# Altium project egse.PrjPcb (part 5 of 5)

## Sheet 7_power_prot_mon.SchDoc: Bus power control & monitoring
size A4; OrganizationName: Pluton UPV; Address1: Universitat Politècnica; Address2: de València (UPV); Address3: Camí de Vera, València; Address4: Spain; SheetNumber: 12; SheetTotal: 12
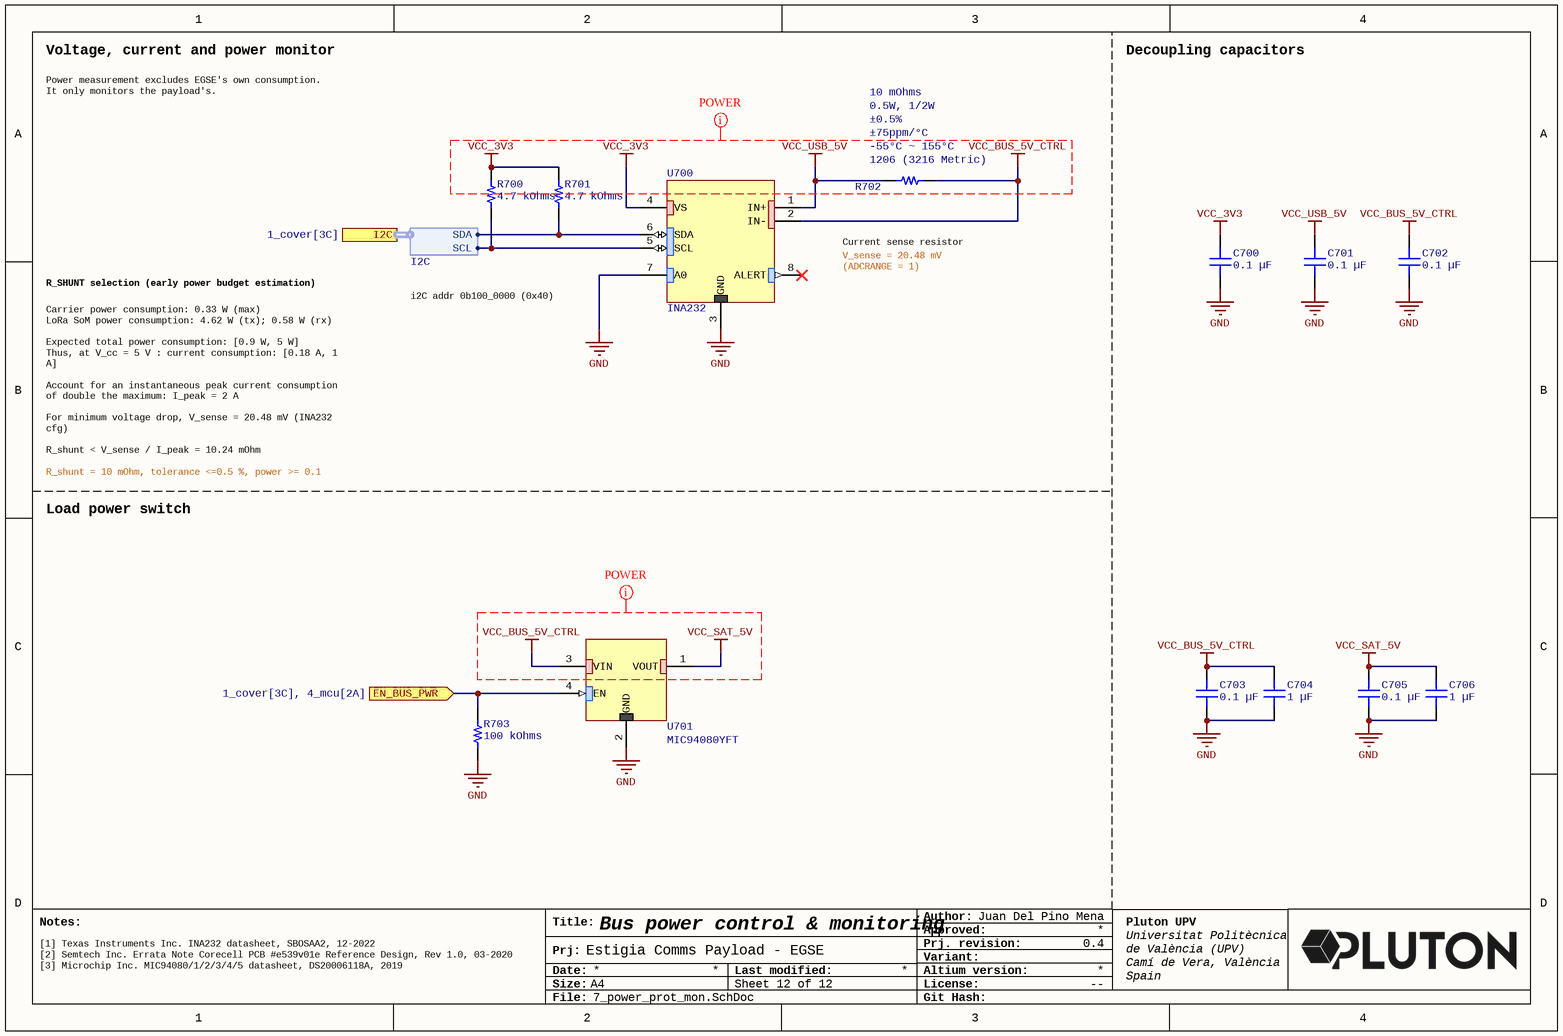
[diagram p10: 7_power_prot_mon.SchDoc]

### Parts
C700  0.1 µF  [CAP 0402_1005]
C701  0.1 µF  [CAP 0402_1005]
C702  0.1 µF  [CAP 0402_1005]
C703  0.1 µF  [CAP 0402_1005]
C704  1 µF  [CAP 0402_1005]
C705  0.1 µF  [CAP 0402_1005]
C706  1 µF  [CAP 0402_1005]
R700  4.7 kOhms  [RES 0201_0603]
R701  4.7 kOhms  [RES 0201_0603]
R702  Package / Case: 1206 (3216 Metric)  Operating Temperature: -55°C ~ 155°C  Power (Watts): 0.5W, 1/2W  Temperature Coefficient: ±75ppm/°C  Tolerance: ±0.5%  [STACKPOLE CSR1206]  (hidden comment: 10 mOhms)
R703  100 kOhms  [RES 0201_0603]
U700  INA232  [SOp-23-8]
U701  MIC94080YFT  [MIC94080YFT]

### Ports
EN_BUS_PWR (in, see 1_cover[3C], 4_mcu[2A]), I2C (harness I2C, see 1_cover[3C])

### Harnesses
I2C: SCL, SDA

### Nets
GND: C700.1 C701.1 C702.1 C703.1 C704.1 C705.1 C706.1 R703.2 U700.3(GND) U700.7(A0) U701.2(GND)
VCC_3V3: C700.2 R700.2 R701.2 U700.4(VS)
VCC_BUS_5V_CTRL: C702.2 C703.2 C704.2 R702.1 U700.2(IN-) U701.3(VIN)
VCC_SAT_5V: C705.2 C706.2 U701.1(VOUT)
VCC_USB_5V: C701.2 R702.2 U700.1(IN+)
EN_BUS_PWR: R703.1 U701.4(EN) ; port EN_BUS_PWR
NetR700_1: R700.1 U700.5(SCL) ; port I2C.SCL
NetR701_1: R701.1 U700.6(SDA) ; port I2C.SDA

Not connected (* = marked no-connect by the designer): U700 8(ALERT)*

### Layout directives
rule Width Constraint [Pref Width = 0.4mm    Min Width = 0.3mm    Max Width = 0.5mm]; net class POWER: VCC_3V3, VCC_BUS_5V_CTRL, VCC_SAT_5V, VCC_USB_5V

### Notes on the sheet
- Voltage, current and power monitor
- Power measurement excludes EGSE's own consumption. It only monitors the payload's.
- Decoupling capacitors
- Current sense resistor
- R_SHUNT selection (early power budget estimation)
- i2C addr 0b100_0000 (0x40)
- V_sense = 20.48 mV (ADCRANGE = 1)
- Carrier power consumption: 0.33 W (max)
  LoRa SoM power consumption: 4.62 W (tx); 0.58 W (rx)
  Expected total power consumption: [0.9 W, 5 W]
  Thus, at V_cc = 5 V : current consumption: [0.18 A, 1 A]
  Account for an instantaneous peak current consumption of double the maximum: I_peak = 2 A
  For minimum voltage drop, V_sense = 20.48 mV (INA232 cfg)
  R_shunt < V_sense / I_peak = 10.24 mOhm
  Power dissipated on R_shunt: 42 mW
- R_shunt = 10 mOhm, tolerance <=0.5 %, power >= 0.1 W
- Load power switch
- [1] Texas Instruments Inc. INA232 datasheet, SBOSAA2, 12-2022
  [2] Semtech Inc. Errata Note Corecell PCB #e539v01e Reference Design, Rev 1.0, 03-2020
  [3] Microchip Inc. MIC94080/1/2/3/4/5 datasheet, DS20006118A, 2019
- Notes:
- Title:
- Author:
- Approved:
- Date:
- Prj:
- Size:
- A4
- Last modified:
- Altium version:
- Variant:
- Prj. revision:
- License:
- --
- File:
- Git Hash:

### Library data of the parts
C700-C703 C705 = C0402C104K4RECAUTO: CAP CER 0402 0.1UF 16V X7R 10%; manufacturer: KEMET; Part Number: C0402C104K4RECAUTO; Value: 0.1 µF; Applications: Automotive, ESD Protection; Capacitance: 0.1 µF; componentlink1description: Datasheet; componentlink1url: https://api.kemet.com/component-edge/download/datasheet/C0402C104K4RECAUTO.pdf; componentlink2description: DigiKey Link; componentlink2url: https://www.digikey.com/en/products/detail/kemet/C0402C104K4RECAUTO/8563695; Device Package: 0402 (1005 Metric); lastupdated: 09/02/2024 20:04:38; Lifecycle Status: Active; Minimum Order: 1; Mounting Type: Surface Mount, MLCC; Operating Temperature: -55°C ~ 125°C; Package / Case: 0402 (1005 Metric); packaging: TapeAndReel; partid: 1731; Part Status: Active; price: 0.01; Ratings: AEC-Q200; series: ESD SMD Auto X7R; Size / Dimension: 0.039" L x 0.020" W (1.00mm x 0.50mm); Supplier 1: DigiKey; Supplier Part Number 1: 399-17167-1-ND; Temperature Coefficient: X7R; Thickness (Max): 0.022" (0.55mm); Tolerance: ±10%; Voltage - Rated: 16V
C704 C706 = GRT155C71A105KE13D: CAP CER 1UF 10V X7S 0402; manufacturer: Murata Electronics; Tolerance: ±10%; Part Number: GRT155C71A105KE13D; Value: 1 µF; Applications: Automotive; Capacitance: 1 µF; componentlink1description: Datasheet; componentlink1url: https://search.murata.co.jp/Ceramy/image/img/A01X/G101/ENG/GRT155C71A105KE13-01.pdf; componentlink2description: DigiKey Link; componentlink2url: https://www.digikey.com/en/products/detail/murata-electronics/GRT155C71A105KE13D/10695747; Device Package: 0402 (1005 Metric); lastupdated: 09/02/2024 20:04:05; Lifecycle Status: Active; Minimum Order: 1; Mounting Type: Surface Mount, MLCC; Operating Temperature: -55°C ~ 125°C; Package / Case: 0402 (1005 Metric); packaging: TapeAndReel; partid: 47127; Part Status: Active; price: 0.04; Ratings: AEC-Q200; series: GRT; Size / Dimension: 0.039" L x 0.020" W (1.00mm x 0.50mm); Supplier 1: DigiKey; Supplier Part Number 1: 490-GRT155C71A105KE13DCT-ND; Temperature Coefficient: X7S; Thickness (Max): 0.024" (0.60mm); Voltage - Rated: 10V
R700 R701 = AC0201FR-074K7L: RES SMD 4.7K OHM 1% 1/20W 0201; Manufacturer: Yageo; Power (Watts): 0.05W, 1/20W; Temperature Coefficient: ±200ppm/°C; Part Number: AC0201FR-074K7L; Value: 4.7 kOhms; ComponentLink1Description: Datasheet; ComponentLink1URL: https://www.yageo.com/upload/media/product/productsearch/datasheet/rchip/PYu-AC_51_RoHS_L_7.pdf; ComponentLink2Description: DigiKey Link; ComponentLink2URL: https://www.digikey.com/en/products/detail/yageo/AC0201FR-074K7L/5894686; Composition: Thick Film; Device Package: 0201 (0603 Metric); Features: Automotive AEC-Q200, Moisture Resistant; Height - Seated (Max): 0.010" (0.26mm); LastUpdated: 04/06/2024 19:11:59; Lifecycle Status: Active; Minimum Order: 1; Number of Terminations: 2; Operating Temperature: -55°C ~ 155°C; Package / Case: 0201 (0603 Metric); Packaging: CutTape; PartId: 978; Part Status: Active; Price: 0.01; Ratings: AEC-Q200; Resistance: 4.7 kOhms; Series: AC; Size / Dimension: 0.024" L x 0.012" W (0.60mm x 0.30mm); Supplier 1: DigiKey; Supplier Part Number 1: YAG3426CT-ND; Supplier Device Package: 0201; Tolerance: ±1%
R702 = L4T12FR010DER: 0.01 OHM 1206 0.5% 0.50W; Manufacturer: Ohmite; Part Number: L4T12FR010DER; ComponentLink1Description: Datasheet; ComponentLink1URL: https://www.ohmite.com/assets/docs/acl_l4t.pdf; ComponentLink2Description: DigiKey Link; ComponentLink2URL: https://www.digikey.com/en/products/detail/ohmite/L4T12FR010DER/10385195; Composition: Thick Film; Device Package: 1206 (3216 Metric); Features: Current Sense; Height - Seated (Max): 0.026" (0.65mm); LastUpdated: 03/06/2024 19:49:34; Lifecycle Status: Active; Minimum Order: 1; Number of Terminations: 4; Packaging: CutTape; PartId: 2184; Part Status: Active; Price: 0.08; Resistance: 10 mOhms; Series: L4T12; Size / Dimension: 0.118" L x 0.063" W (3.00mm x 1.60mm); Supplier 1: DigiKey; Supplier Part Number 1: 273-L4T12FR010DERCT-ND; Supplier Device Package: 1206; Value: 10 mOhms
R703 = RC0201FR-13100KL: RES 100K OHM 1% 1/20W 0201; Manufacturer: Yageo; Power (Watts): 0.05W, 1/20W; Temperature Coefficient: ±200ppm/°C; Part Number: RC0201FR-13100KL; Value: 100 kOhms; ComponentLink1Description: Datasheet; ComponentLink1URL: https://www.yageo.com/upload/media/product/productsearch/datasheet/rchip/PYu-RC_Group_51_RoHS_L_12.pdf; ComponentLink2Description: DigiKey Link; ComponentLink2URL: https://www.digikey.com/en/products/detail/yageo/RC0201FR-13100KL/17014509; Composition: Thick Film; Device Package: 0201 (0603 Metric); Features: Moisture Resistant; Height - Seated (Max): 0.010" (0.26mm); LastUpdated: 04/06/2024 19:11:47; Lifecycle Status: Active; Minimum Order: 1; Number of Terminations: 2; Operating Temperature: -55°C ~ 125°C; Package / Case: 0201 (0603 Metric); Packaging: CutTape; PartId: 80199; Price: 0.01; Resistance: 100 kOhms; Series: RC_L; Size / Dimension: 0.024" L x 0.012" W (0.60mm x 0.30mm); Supplier 1: DigiKey; Supplier Part Number 1: 13-RC0201FR-13100KLCT-ND; Supplier Device Package: 0201; Tolerance: ±1%
U700 = INA232: 48-V, 16-Bit, Current, Voltage, and Power Monitor With an I2C Interface
U701 = MIC94080YFT: 67 mΩ RDS(ON) 2A High-Side Load Switch in 0.85 mm x 0.85 mm FTDFN Package

## Sheet 3_ports.SchDoc: Ports
size A4; OrganizationName: Pluton UPV; Address1: Universitat Politècnica; Address2: de València (UPV); Address3: Camí de Vera, València; Address4: Spain; SheetNumber: 4; SheetTotal: 12
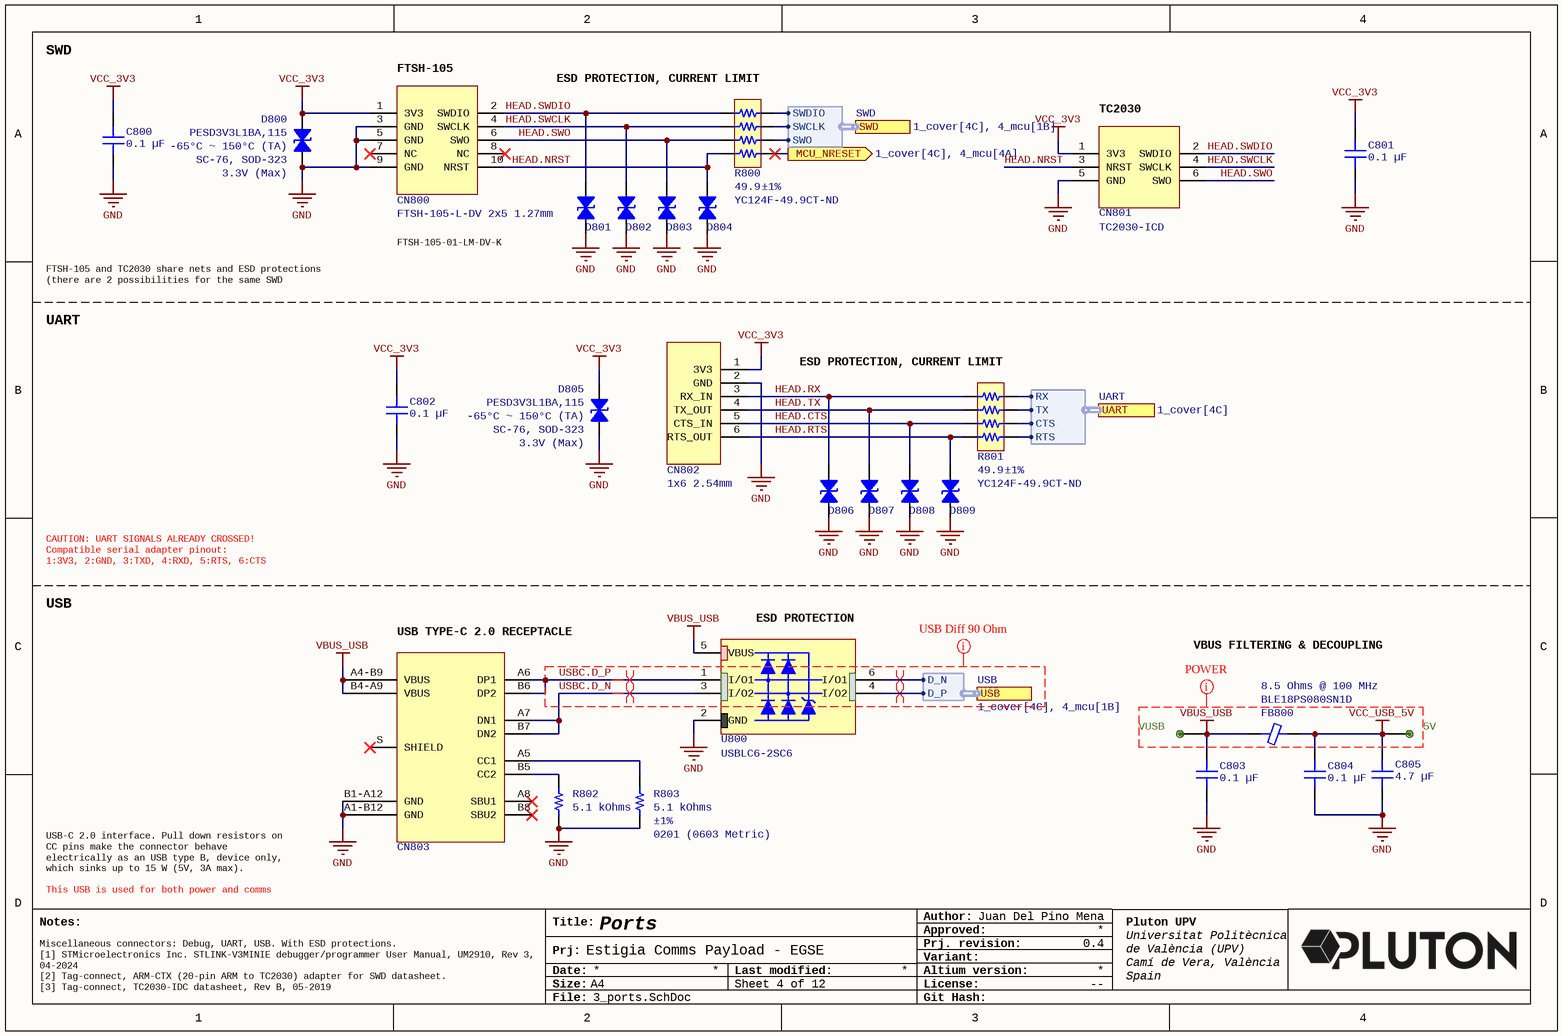
[diagram p11: 3_ports.SchDoc]

### Parts
5V  (no value)  [testpoint_via]  (no BOM)
C800  0.1 µF  [CAP 0402_1005]
C801  0.1 µF  [CAP 0402_1005]
C802  0.1 µF  [CAP 0402_1005]
C803  0.1 µF  [CAP 0402_1005]
C804  0.1 µF  [CAP 0402_1005]
C805  4.7 µF  [CAP 0603_1608]
CN800  FTSH-105-L-DV 2x5 1.27mm  [Samtec ftsh-105-l-dv]
CN801  TC2030-ICD  [TC2030-MCP-NL]  (no BOM)
CN802  1x6 2.54mm  [Header 1x6 2.54mm]  (no BOM)
CN803  USB4105-GF-A  [USB4105-GF-A]  (value not drawn)
D800  Operating Temperature: -65°C ~ 150°C (TA)  Package / Case: SC-76, SOD-323  Voltage - Reverse Standoff (Typ): 3.3V (Max)  [SOD323]  (hidden comment: PESD3V3L1BA,115)
D801  PESD3V3L1BA,115  [SOD323]  (value not drawn)
D802  PESD3V3L1BA,115  [SOD323]  (value not drawn)
D803  PESD3V3L1BA,115  [SOD323]  (value not drawn)
D804  PESD3V3L1BA,115  [SOD323]  (value not drawn)
D805  Operating Temperature: -65°C ~ 150°C (TA)  Package / Case: SC-76, SOD-323  Voltage - Reverse Standoff (Typ): 3.3V (Max)  [SOD323]  (hidden comment: PESD3V3L1BA,115)
D806  PESD3V3L1BA,115  [SOD323]  (value not drawn)
D807  PESD3V3L1BA,115  [SOD323]  (value not drawn)
D808  PESD3V3L1BA,115  [SOD323]  (value not drawn)
D809  PESD3V3L1BA,115  [SOD323]  (value not drawn)
FB800  Part Number: BLE18PS080SN1D  [FER 0603_1608]  (hidden comment: 8.5 Ohms @ 100 MHz)
R800  Resistance (Ohms): 49.9  Supplier Part Number 1: YC124F-49.9CT-ND  Tolerance: ±1%  [RESNET 0804-8 CONVEX]  (hidden comment: YC124-FR-0749R9L)
R801  Resistance (Ohms): 49.9  Supplier Part Number 1: YC124F-49.9CT-ND  Tolerance: ±1%  [RESNET 0804-8 CONVEX]  (hidden comment: YC124-FR-0749R9L)
R802  5.1 kOhms  [RES 0201_0603]
R803  Device Package: 0201 (0603 Metric)  Tolerance: ±1%  [RES 0201_0603]  (hidden comment: 5.1 kOhms)
U800  USBLC6-2SC6  [SOT23-6L]
VUSB  (no value)  [testpoint_via]  (no BOM)

### Ports
MCU_NRESET (out, see 1_cover[4C], 4_mcu[4A]), SWD (harness SWD, see 1_cover[4C], 4_mcu[1B]), UART (harness UART, see 1_cover[4C]), USB (harness USB, see 1_cover[4C], 4_mcu[1B])

### Harnesses
SWD: SWDIO, SWCLK, SWO
UART: TX, CTS, RTS, RX
USB: D_N, D_P

### Nets
GND: C800.1 C801.1 C802.1 C803.1 C804.1 C805.1 CN800.3(GND) CN800.5(GND) CN800.9(GND) CN801.5(GND) CN802.2(GND) CN803.A1-B12(GND) CN803.B1-A12(GND) D800.1 D801.1 D802.1 D803.1 D804.1 D805.1 D806.1 D807.1 D808.1 D809.1 R802.1 R803.1 U800.2(GND)
VBUS_USB: C803.2 CN803.A4-B9(VBUS) CN803.B4-A9(VBUS) FB800.1 U800.5(VBUS) VUSB.0
VCC_3V3: C800.2 C801.2 C802.2 CN800.1(3V3) CN801.1(3V3) CN802.1(3V3) D800.2 D805.2
VCC_USB_5V: 5V.0 C804.2 C805.2 FB800.2
HEAD.CTS: CN802.5(CTS_IN) D808.2 R801.3  [project net HEAD.CTS_4]
HEAD.NRST: CN800.10(NRST) CN801.3(NRST) D804.2 R800.4  [project net HEAD.NRST_4]
HEAD.RTS: CN802.6(RTS_OUT) D809.2 R801.4  [project net HEAD.RTS_4]
HEAD.RX: CN802.3(RX_IN) D806.2 R801.1  [project net HEAD.RX_4]
HEAD.SWCLK: CN800.4(SWCLK) CN801.4(SWCLK) D802.2 R800.2  [project net HEAD.SWCLK_4]
HEAD.SWDIO: CN800.2(SWDIO) CN801.2(SWDIO) D801.2 R800.1  [project net HEAD.SWDIO_4]
HEAD.SWO: CN800.6(SWO) CN801.6(SWO) D803.2 R800.3  [project net HEAD.SWO_4]
HEAD.TX: CN802.4(TX_OUT) D807.2 R801.2  [project net HEAD.TX_4]
MCU_NRESET: R800.5 ; port MCU_NRESET
SWD.SWO: R800.6 ; port SWD.SWO
UART4.CTS: R801.6 ; port UART.CTS
UART4.RTS: R801.5 ; port UART.RTS
USBC.D_N: CN803.A7(DN1) CN803.B7(DN2) U800.3(I/O2)  [project net USBC.D_N_4]
USBC.D_P: CN803.A6(DP1) CN803.B6(DP2) U800.1(I/O1)  [project net USBC.D_P_4]
NetCN803_A5: CN803.A5(CC1) R803.2
NetCN803_B5: CN803.B5(CC2) R802.2
NetR800_7: R800.7 ; port SWD.SWCLK
NetR800_8: R800.8 ; port SWD.SWDIO
NetR801_7: R801.7 ; port UART.TX
NetR801_8: R801.8 ; port UART.RX
NetU400_44: U800.6(I/O1) ; port USB.D_N
NetU400_45: U800.4(I/O2) ; port USB.D_P

Not connected (* = marked no-connect by the designer): CN800 7(NC)* 8(NC)*; CN803 A8(SBU1)* B8(SBU2)* S(SHIELD)*

### Layout directives
differential pair: NetU400_44, NetU400_45, USBC.D_N_4, USBC.D_P_4
rule Width Constraint [Pref Width = 0.4mm    Min Width = 0.3mm    Max Width = 0.5mm]; net class POWER: VBUS_USB, VCC_USB_5V
net class USB90; rule Differential Pairs Routing [Pref Gap = 0.127mm    Min Gap  = 0.127mm    Max Gap  = 0.127mmPref Width = 0.269mm    Min Width  = 0.269mm    Max Width  = 0.269mm]: USBC.D_N, USBC.D_P

### Notes on the sheet
- SWD
- (near CN800) FTSH-105
- (near R800) ESD PROTECTION, CURRENT LIMIT
- (near CN801) TC2030
- FTSH-105-01-LM-DV-K
- FTSH-105 and TC2030 share nets and ESD protections (there are 2 possibilities for the same SWD interface!)
- UART
- (near R801) ESD PROTECTION, CURRENT LIMIT
- CAUTION: UART SIGNALS ALREADY CROSSED!
  Compatible serial adapter pinout:
  1:3V3, 2:GND, 3:TXD, 4:RXD, 5:RTS, 6:CTS
- USB
- (near CN803) USB TYPE-C 2.0 RECEPTACLE
- (near U800) ESD PROTECTION
- VBUS FILTERING & DECOUPLING
- USB-C 2.0 interface. Pull down resistors on CC pins make the connector behave electrically as an USB type B, device only, which sinks up to 15 W (5V, 3A max).
- This USB is used for both power and comms
- Miscellaneous connectors: Debug, UART, USB. With ESD protections.
  [1] STMicroelectronics Inc. STLINK-V3MINIE debugger/programmer User Manual, UM2910, Rev 3, 04-2024
  [2] Tag-connect, ARM-CTX (20-pin ARM to TC2030) adapter for SWD datasheet.
  [3] Tag-connect, TC2030-IDC datasheet, Rev B, 05-2019
  [4] STMicroelectronics Inc. AN4879, Rev 6,
- Notes:
- Title:
- Author:
- Approved:
- Date:
- Prj:
- Size:
- A4
- Last modified:
- Altium version:
- Variant:
- Prj. revision:
- License:
- --
- File:
- Git Hash:

### Library data of the parts
5V VUSB = TestPoint-VIA: Test point, thru-hole
C800-C804 = C0402C104K4RECAUTO: as C700 on sheet 7_power_prot_mon; Part Number: C0402C104K4RECAUTO; Value: 0.1 µF; Applications: Automotive, ESD Protection; Capacitance: 0.1 µF; componentlink1description: Datasheet; componentlink1url: https://api.kemet.com/component-edge/download/datasheet/C0402C104K4RECAUTO.pdf; componentlink2description: DigiKey Link; componentlink2url: https://www.digikey.com/en/products/detail/kemet/C0402C104K4RECAUTO/8563695; Device Package: 0402 (1005 Metric); lastupdated: 09/02/2024 20:04:38; Lifecycle Status: Active; Minimum Order: 1; Mounting Type: Surface Mount, MLCC; Operating Temperature: -55°C ~ 125°C; Package / Case: 0402 (1005 Metric); packaging: TapeAndReel; partid: 1731; Part Status: Active; price: 0.01; Ratings: AEC-Q200; series: ESD SMD Auto X7R; Size / Dimension: 0.039" L x 0.020" W (1.00mm x 0.50mm); Supplier 1: DigiKey; Supplier Part Number 1: 399-17167-1-ND; Temperature Coefficient: X7R; Thickness (Max): 0.022" (0.55mm); Tolerance: ±10%; Voltage - Rated: 16V
C805 = GRM188Z71C475KE21J: CAP CER 4.7UF 16V X7R 0603; manufacturer: Murata Electronics; Tolerance: ±10%; Part Number: GRM188Z71C475KE21J; Value: 4.7 µF; Applications: General Purpose; Capacitance: 4.7 µF; componentlink1description: Datasheet; componentlink1url: https://search.murata.co.jp/Ceramy/image/img/A01X/G101/ENG/GRM188Z71C475KE21-01A.pdf; componentlink2description: DigiKey Link; componentlink2url: https://www.digikey.com/en/products/detail/murata-electronics/GRM188Z71C475KE21J/16033436; Device Package: 0603 (1608 Metric); lastupdated: 09/02/2024 20:09:51; Lifecycle Status: Active; Minimum Order: 1; Mounting Type: Surface Mount, MLCC; Operating Temperature: -55°C ~ 125°C; Package / Case: 0603 (1608 Metric); packaging: TapeAndReel; partid: 41988; Part Status: Active; price: 0.04; series: GRM; Size / Dimension: 0.063" L x 0.031" W (1.60mm x 0.80mm); Supplier 1: DigiKey; Supplier Part Number 1: 490-GRM188Z71C475KE21JCT-ND; Temperature Coefficient: X7R; Thickness (Max): 0.039" (1.00mm); Voltage - Rated: 16V
CN800 = SWD Header 2x5 1.27mm: Samtec FTSH-105-L-DV
CN802 = UART Header 1x6 2.54mm: Header 1x6 2.54mm
CN803 = USB-C USB4105-GF-A: z
D800 D805 = PESD3V3L1BA,115: TVS DIODE 3.3VWM 26VC SOD323; Manufacturer: Nexperia USA Inc.; Bidirectional Channels: 1; Capacitance @ Frequency: 101pF @ 1MHz; Current - Peak Pulse (10/1000µs): 18A (8/20µs); Power Line Protection: No; Power - Peak Pulse: 500W; Type: Zener; Voltage - Breakdown (Min): 5.8V; Voltage - Clamping (Max) @ Ipp: 26V; Part Number: PESD3V3L1BA,115; Applications: General Purpose; ComponentLink1Description: Datasheet; ComponentLink1URL: https://assets.nexperia.com/documents/data-sheet/PESDXL1BA_SER.pdf; ComponentLink2Description: DigiKey Link; ComponentLink2URL: https://www.digikey.com/en/products/detail/nexperia-usa-inc/PESD3V3L1BA-115/1157438; LastUpdated: 03/06/2024 20:22:28; Lifecycle Status: Active; Minimum Order: 1; Mounting Type: Surface Mount; Packaging: TapeAndReel; PartId: 9994; Part Status: Active; Price: 0.06; Series: -; Supplier 1: DigiKey; Supplier Part Number 1: 1727-3825-1-ND; Supplier Device Package: SOD-323
D801-D804 D806-D809 = PESD3V3L1BA,115: TVS DIODE 3.3VWM 26VC SOD323; Manufacturer: Nexperia USA Inc.; Bidirectional Channels: 1; Capacitance @ Frequency: 101pF @ 1MHz; Current - Peak Pulse (10/1000µs): 18A (8/20µs); Power Line Protection: No; Power - Peak Pulse: 500W; Type: Zener; Voltage - Breakdown (Min): 5.8V; Voltage - Clamping (Max) @ Ipp: 26V; Voltage - Reverse Standoff (Typ): 3.3V (Max); Part Number: PESD3V3L1BA,115; Applications: General Purpose; ComponentLink1Description: Datasheet; ComponentLink1URL: https://assets.nexperia.com/documents/data-sheet/PESDXL1BA_SER.pdf; ComponentLink2Description: DigiKey Link; ComponentLink2URL: https://www.digikey.com/en/products/detail/nexperia-usa-inc/PESD3V3L1BA-115/1157438; LastUpdated: 03/06/2024 20:22:28; Lifecycle Status: Active; Minimum Order: 1; Mounting Type: Surface Mount; Operating Temperature: -65°C ~ 150°C (TA); Package / Case: SC-76, SOD-323; Packaging: TapeAndReel; PartId: 9994; Part Status: Active; Price: 0.06; Series: -; Supplier 1: DigiKey; Supplier Part Number 1: 1727-3825-1-ND; Supplier Device Package: SOD-323
FB800 = BLE18PS080SN1D: FERRITE BEAD 8.5 OHM 0603 1LN; Manufacturer: Murata Electronics; Current Rating (Max): 8A; DC Resistance (DCR) (Max): 4mOhm; Filter Type: Power Line; Number of Lines: 1; ComponentLink1Description: Datasheet; ComponentLink1URL: https://www.murata.com/products/productdata/8800169525278/ENFA0080.pdf; ComponentLink2Description: DigiKey Link; ComponentLink2URL: https://www.digikey.com/en/products/detail/murata-electronics/BLE18PS080SN1D/13904803; Device Package: 0603 (1608 Metric); Height (Max): 0.030" (0.75mm); Impedance @ Frequency: 8.5 Ohms @ 100 MHz; LastUpdated: 03/06/2024 19:51:46; Lifecycle Status: Active; Minimum Order: 1; Mounting Type: Surface Mount; Operating Temperature: -55°C ~ 125°C; Package / Case: 0603 (1608 Metric); Packaging: TapeAndReel; PartId: 2651; Part Status: Active; Price: 0.08; Series: EMIFIL®, BLE18; Size / Dimension: 0.063" L x 0.031" W (1.60mm x 0.80mm); Supplier 1: DigiKey; Supplier Part Number 1: 490-BLE18PS080SN1DCT-ND; Value: 8.5 Ohms @ 100 MHz
R800 R801 = YC124-FR-0749R9L: RES ARRAY 4 RES 49.9 OHM 0804; Manufacturer: Yageo; Circuit Type: Isolated; Number of Resistors: 4; Power Per Element: 62.5mW; Temperature Coefficient: ±200ppm/°C; Part Number: YC124-FR-0749R9L; Applications: DDRAM, SDRAM; ComponentLink1Description: Datasheet; ComponentLink1URL: https://www.yageo.com/upload/media/product/productsearch/datasheet/rchip/PYu-YC_TC_group_51_RoHS_L_9.pdf; ComponentLink2Description: DigiKey Link; ComponentLink2URL: https://www.digikey.com/en/products/detail/yageo/YC124-FR-0749R9L/2827647; Height - Seated (Max): 0.022" (0.55mm); LastUpdated: 03/06/2024 20:05:56; Lifecycle Status: Active; Minimum Order: 1; Mounting Type: Surface Mount; Number of Pins: 8; Operating Temperature: -55°C ~ 155°C; Package / Case: 0804, Convex, Long Side Terminals; Packaging: TapeAndReel; PartId: 501; Part Status: Active; Price: 0.03; Series: YC124; Size / Dimension: 0.079" L x 0.039" W (2.00mm x 1.00mm); Supplier 1: DigiKey
R802 R803 = AC0201FR-075K1L: RES SMD 5.1K OHM 1% 1/20W 0201; Manufacturer: Yageo; Power (Watts): 0.05W, 1/20W; Temperature Coefficient: ±200ppm/°C; Part Number: AC0201FR-075K1L; Value: 5.1 kOhms; ComponentLink1Description: Datasheet; ComponentLink1URL: https://www.yageo.com/upload/media/product/productsearch/datasheet/rchip/PYu-AC_51_RoHS_L_7.pdf; ComponentLink2Description: DigiKey Link; ComponentLink2URL: https://www.digikey.com/en/products/detail/yageo/AC0201FR-075K1L/5894738; Composition: Thick Film; Features: Automotive AEC-Q200, Moisture Resistant; Height - Seated (Max): 0.010" (0.26mm); LastUpdated: 04/06/2024 19:12:02; Lifecycle Status: Active; Minimum Order: 1; Number of Terminations: 2; Operating Temperature: -55°C ~ 155°C; Package / Case: 0201 (0603 Metric); Packaging: TapeAndReel; PartId: 225; Part Status: Active; Price: 0.01; Ratings: AEC-Q200; Resistance: 5.1 kOhms; Series: AC; Size / Dimension: 0.024" L x 0.012" W (0.60mm x 0.30mm); Supplier 1: DigiKey; Supplier Part Number 1: YAG5228CT-ND; Supplier Device Package: 0201
  R802: Device Package: 0201 (0603 Metric); Tolerance: ±1%

## Nets that join several sheets
GND: 2_cubesat_bus (34 pins), 2_1_bus_breakout (10 pins), 6_power_dcdc (42 pins), 4_mcu (21 pins), 5_rf_path (29 pins), 5_2_switches (22 pins), 5_3_frontend (24 pins), 5_1_attenuators (46 pins), 5_4_transceiver (21 pins), 7_power_prot_mon (11 pins), 3_ports (26 pins)
VCC_3V3: 2_cubesat_bus (8 pins), 6_power_dcdc (12 pins), 4_mcu (13 pins), 7_power_prot_mon (C700.2 R700.2 R701.2 U700.4), 3_ports (8 pins)
VCC_RF_3V3: 6_power_dcdc (7 pins), 5_2_switches (8 pins), 5_3_frontend (5 pins), 5_1_attenuators (20 pins), 5_4_transceiver (9 pins)
VCC_RF_3V9: 6_power_dcdc (8 pins), 5_3_frontend (8 pins)
VCC_SAT_5V: 2_cubesat_bus (16 pins), 2_1_bus_breakout (CN202.25 CN202.26 CN203.25 CN203.26), 7_power_prot_mon (C705.2 C706.2 U701.1)
VCC_USB_5V: 6_power_dcdc (14 pins), 7_power_prot_mon (C701.2 R702.2 U700.1), 3_ports (5V.0 C804.2 C805.2 FB800.2)
ANTENNA: 5_rf_path (L500.1), 5_1_attenuators (U500.2)
ATT_CTRL.C0_5: 4_mcu (U400.40), 5_rf_path (C509.2 R502.9), 5_1_attenuators (U502.20 U503.20 U504.20 U505.20)
ATT_CTRL.C1: 4_mcu (U400.39), 5_rf_path (C508.2 R502.10), 5_1_attenuators (U502.19 U503.19 U504.19 U505.19)
ATT_CTRL.C2: 4_mcu (U400.38), 5_rf_path (C507.2 R502.11), 5_1_attenuators (U502.17 U503.17 U504.17 U505.17)
ATT_CTRL.C4: 4_mcu (U400.43), 5_rf_path (C506.2 R502.12), 5_1_attenuators (U502.16 U503.16 U504.16 U505.16)
ATT_CTRL.C8: 4_mcu (U400.42), 5_rf_path (C505.2 R502.13), 5_1_attenuators (U502.15 U503.15 U504.15 U505.15)
ATT_CTRL.C16: 4_mcu (U400.41), 5_rf_path (C504.2 R502.14), 5_1_attenuators (R503.1 R504.1 R505.1 R506.1)
CAN_A_H: 2_cubesat_bus (CN200.3 R200.2 U200.7), 2_1_bus_breakout (CN202.3)
CAN_A_L: 2_cubesat_bus (CN200.1 R200.1 U200.6), 2_1_bus_breakout (CN202.1)
CAN_A_STBY: 2_cubesat_bus (R201.2 U200.8), 4_mcu (U400.16)
CAN_B_H: 2_cubesat_bus (CN201.3 R204.2 U201.7), 2_1_bus_breakout (CN203.3)
CAN_B_L: 2_cubesat_bus (CN201.1 R204.1 U201.6), 2_1_bus_breakout (CN203.1)
CAN_B_STBY: 2_cubesat_bus (R205.2 U201.8), 4_mcu (U400.17)
EN_BUS_PWR: 4_mcu (U400.37), 7_power_prot_mon (R703.1 U701.4)
EN_RF_PWR: 6_power_dcdc (R603.2), 4_mcu (U400.56)
FE_TR: 5_3_frontend (R513.2), 5_4_transceiver (U509.20)
KILL_3V3: 2_cubesat_bus (C200.2 Q200.1), 4_mcu (U400.53)
KILL_5V: 2_cubesat_bus (6 pins), 2_1_bus_breakout (CN203.39 CN203.40)
MCU_NRESET: 4_mcu (5 pins), 3_ports (R800.5)
NetC548_2: 4_mcu (U400.20), 5_4_transceiver (C548.2 U509.19)
NetR500_1: 4_mcu (U400.11), 5_rf_path (R500.1)
NetR500_2: 4_mcu (U400.10), 5_rf_path (R500.2)
NetR500_3: 4_mcu (U400.52), 5_rf_path (R500.3)
NetR500_4: 4_mcu (U400.51), 5_rf_path (R500.4)
NetR700_1: 4_mcu (U400.8), 7_power_prot_mon (R700.1 U700.5)
NetR701_1: 4_mcu (U400.9), 7_power_prot_mon (R701.1 U700.6)
NetR800_7: 4_mcu (U400.49), 3_ports (R800.7)
NetR800_8: 4_mcu (U400.46), 3_ports (R800.8)
NetR801_7: 4_mcu (U400.14), 3_ports (R801.7)
NetR801_8: 4_mcu (U400.15), 3_ports (R801.8)
NetU200_1: 2_cubesat_bus (U200.1), 4_mcu (U400.62)
NetU200_4: 2_cubesat_bus (U200.4), 4_mcu (U400.61)
NetU201_1: 2_cubesat_bus (U201.1), 4_mcu (U400.58)
NetU201_4: 2_cubesat_bus (U201.4), 4_mcu (U400.57)
NetU400_21: 4_mcu (U400.21), 5_4_transceiver (U509.16)
NetU400_22: 4_mcu (U400.22), 5_4_transceiver (U509.17)
NetU400_23: 4_mcu (U400.23), 5_4_transceiver (U509.18)
NetU400_44: 4_mcu (U400.44), 3_ports (U800.6)
NetU400_45: 4_mcu (U400.45), 3_ports (U800.4)
PGOOD.3V3DC: 6_power_dcdc (PG3V3D.0 R600.1 U600.5), 4_mcu (U400.28)
PGOOD.3V3RF: 6_power_dcdc (PG3V3RF.0 R604.1 U601.5), 4_mcu (U400.27)
PGOOD.3V9RF: 6_power_dcdc (PG3V9RF.0 R611.1 U602.5), 4_mcu (U400.26)
RADIO_NRST: 4_mcu (U400.25), 5_4_transceiver (U509.7)
RBF_3V3: 2_cubesat_bus (C202.2 Q201.1), 4_mcu (U400.2)
RBF_5V: 2_cubesat_bus (6 pins), 2_1_bus_breakout (CN203.37 CN203.38)
RF_IO: 5_2_switches (U506.11), 5_3_frontend (U508.7)
RF_IO_ATT: 5_2_switches (U507.11), 5_1_attenuators (U505.14)
RF_RXIN: 5_3_frontend (C532.1), 5_4_transceiver (C550.1)
RF_TXIN: 5_3_frontend (C531.1), 5_4_transceiver (C543.2 C547.2)
SW1_CTRL_F.V1: 5_rf_path (C503.2 R500.8 R501.1), 5_2_switches (U506.4)
SW1_CTRL_F.V2: 5_rf_path (C502.2 R500.7 R501.2), 5_2_switches (U506.5)
SW2_CTRL_F.V1: 5_rf_path (C501.2 R500.6 R501.3), 5_2_switches (U507.4)
SW2_CTRL_F.V2: 5_rf_path (C500.2 R500.5 R501.4), 5_2_switches (U507.5)
SWD.SWO: 4_mcu (U400.55), 3_ports (R800.6)
UART4.CTS: 4_mcu (U400.59), 3_ports (R801.6)
UART4.RTS: 4_mcu (U400.50), 3_ports (R801.5)